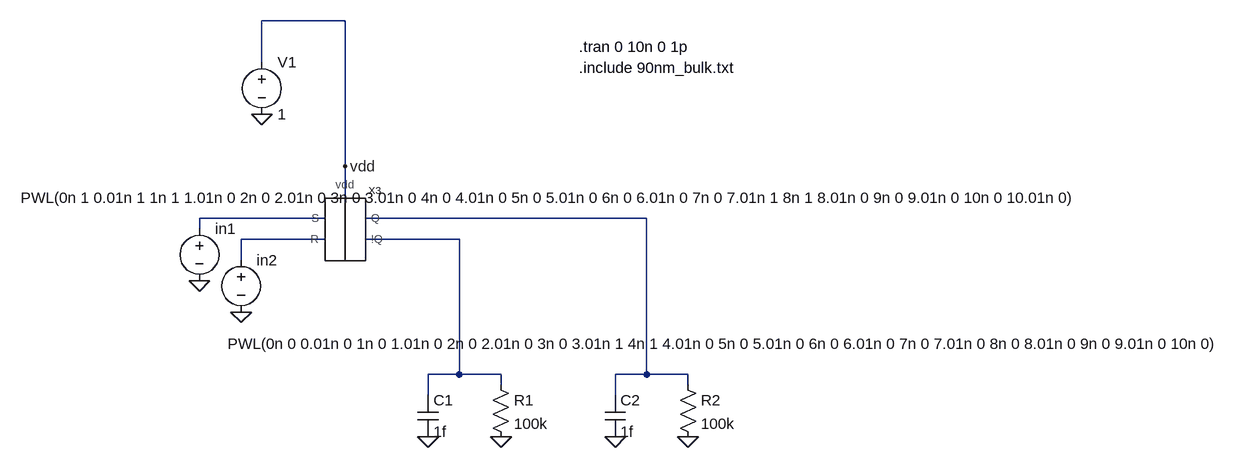
[diagram p0: schematic rs-trigger-test.asc]
rs-trigger-test.asc, the LTspice schematic file:
Version 4
SHEET 1 1484 680
WIRE -96 -320 -224 -320
WIRE -224 -256 -224 -320
WIRE -96 -96 -96 -320
WIRE -96 -48 -96 -96
WIRE -128 -16 -320 -16
WIRE 368 -16 -64 -16
WIRE -320 0 -320 -16
WIRE -128 16 -256 16
WIRE 80 16 -64 16
WIRE -256 48 -256 16
WIRE 80 224 80 16
WIRE 80 224 32 224
WIRE 144 224 80 224
WIRE 368 224 368 -16
WIRE 368 224 320 224
WIRE 432 224 368 224
WIRE 144 240 144 224
WIRE 432 240 432 224
WIRE 32 256 32 224
WIRE 320 256 320 224
FLAG -320 80 0
FLAG 32 320 0
FLAG 144 320 0
FLAG 320 320 0
FLAG 432 320 0
FLAG -96 -96 vdd
FLAG -256 128 0
FLAG -224 -176 0
SYMBOL voltage -320 -16 R0
WINDOW 123 0 0 Left 2
WINDOW 39 0 0 Left 2
WINDOW 3 -275 -32 Left 2
SYMATTR Value PWL(0n 1 0.01n 1 1n 1 1.01n 0 2n 0 2.01n 0 3n 0 3.01n 0 4n 0 4.01n 0 5n 0 5.01n 0 6n 0 6.01n 0 7n 0 7.01n 1 8n 1 8.01n 0 9n 0 9.01n 0 10n 0 10.01n 0)
SYMATTR InstName in1
SYMBOL res 128 224 R0
SYMATTR InstName R1
SYMATTR Value 100k
SYMBOL cap 16 256 R0
SYMATTR InstName C1
SYMATTR Value 1f
SYMBOL res 416 224 R0
SYMATTR InstName R2
SYMATTR Value 100k
SYMBOL cap 304 256 R0
SYMATTR InstName C2
SYMATTR Value 1f
SYMBOL rs -96 0 R0
SYMATTR InstName X3
SYMBOL voltage -256 32 R0
WINDOW 123 0 0 Left 2
WINDOW 39 0 0 Left 2
WINDOW 3 -21 145 Left 2
SYMATTR Value PWL(0n 0 0.01n 0 1n 0 1.01n 0 2n 0 2.01n 0 3n 0 3.01n 1 4n 1 4.01n 0 5n 0 5.01n 0 6n 0 6.01n 0 7n 0 7.01n 0 8n 0 8.01n 0 9n 0 9.01n 0 10n 0)
SYMATTR InstName in2
SYMBOL voltage -224 -272 R0
WINDOW 123 0 0 Left 2
WINDOW 39 0 0 Left 2
SYMATTR InstName V1
SYMATTR Value 1
TEXT 264 -248 Left 2 !.include 90nm_bulk.txt
TEXT 264 -280 Left 2 !.tran 0 10n 0 1p

The netlist it stands for:
* rs-trigger-test.asc
V§in1 N001 0 PWL(0n 1 0.01n 1 1n 1 1.01n 0 2n 0 2.01n 0 3n 0 3.01n 0 4n 0 4.01n 0 5n 0 5.01n 0 6n 0 6.01n 0 7n 0 7.01n 1 8n 1 8.01n 0 9n 0 9.01n 0 10n 0 10.01n 0)
R1 N004 0 100k
C1 N004 0 1f
R2 N002 0 100k
C2 N002 0 1f
XX3 N001 N003 N002 N004 vdd rs  ; pins S R Q !Q vdd
V§in2 N003 0 PWL(0n 0 0.01n 0 1n 0 1.01n 0 2n 0 2.01n 0 3n 0 3.01n 1 4n 1 4.01n 0 5n 0 5.01n 0 6n 0 6.01n 0 7n 0 7.01n 0 8n 0 8.01n 0 9n 0 9.01n 0 10n 0)
V1 vdd 0 1
.include 90nm_bulk.txt
.tran 0 10n 0 1p
.backanno
.end